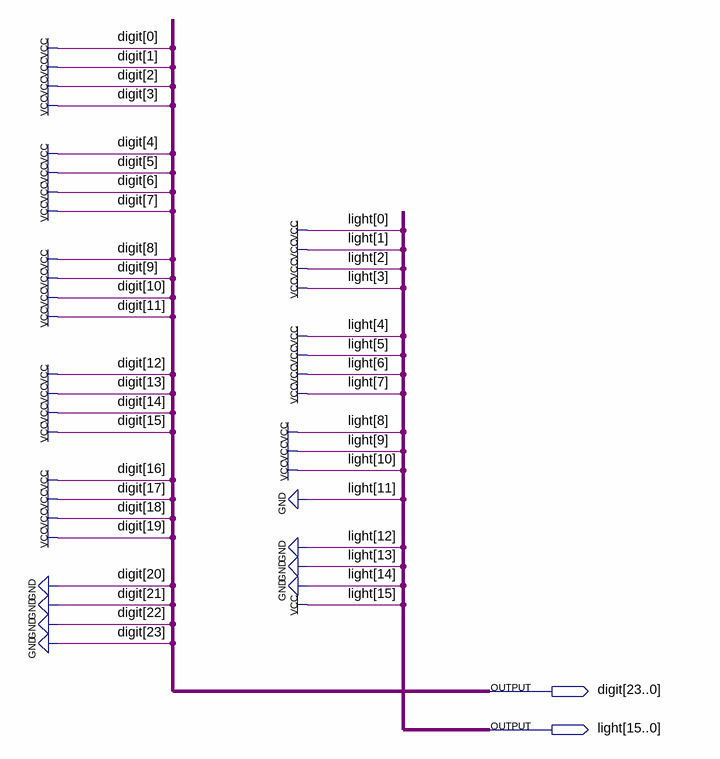
[diagram p0: schematic sheet]
// Quartus schematic Pattern_6_Frame_11.bdf as structural Verilog: 0 symbols, 2 pins
module Pattern_6_Frame_11 (
  output [23:0] digit,
  output [15:0] light
);


  assign digit = 24'b000011111111111111111111;
  assign light = 16'b1000011111111111;
endmodule
